# EAGLE design CANBUS Interface Board 2.2 (EAGLE 8.6.0)
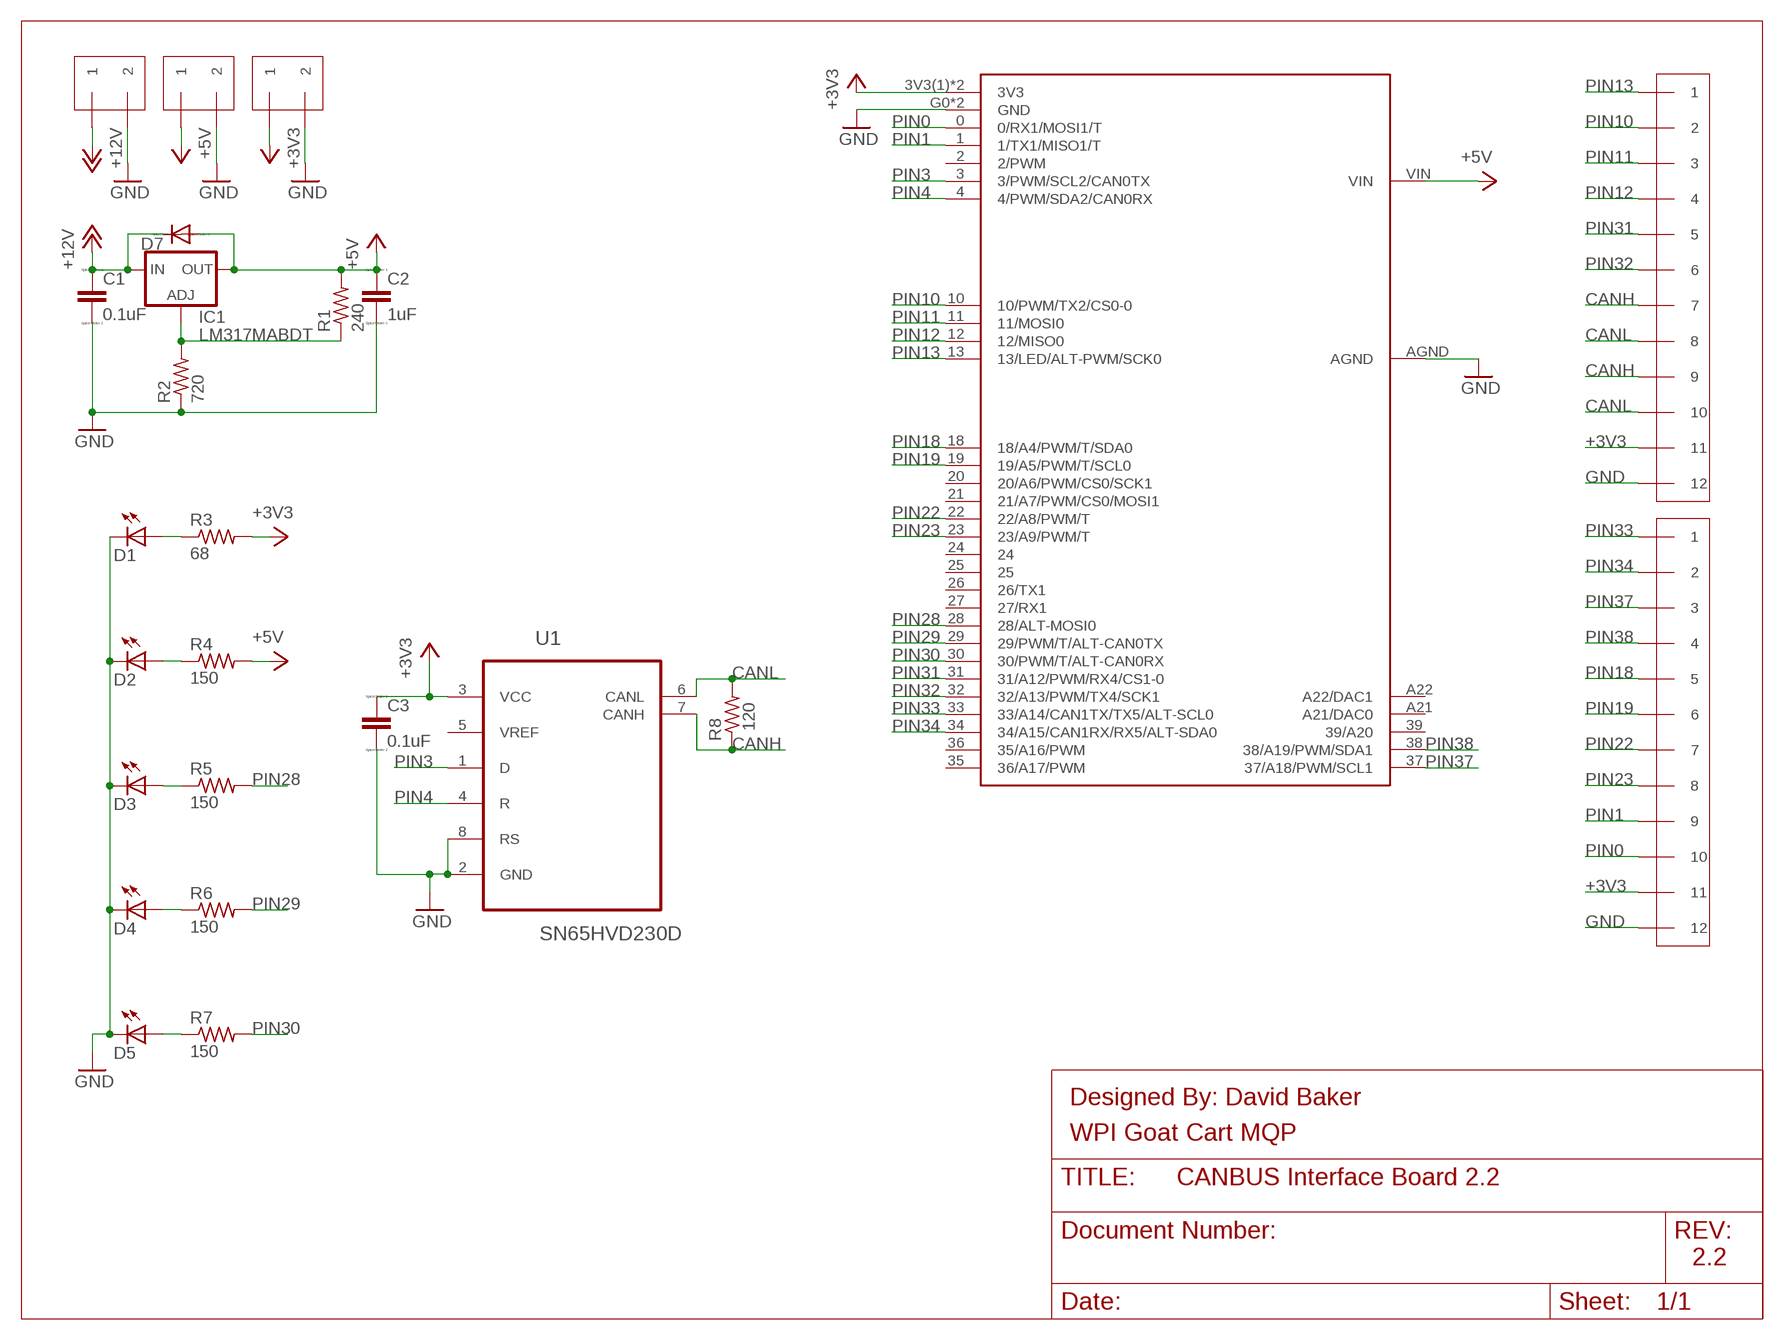
[diagram p0: schematic, sheet 1]

## Parts
C1  0.1uF  CC0603  [C0603]
C2  1uF  CC0603  [C0603]
C3  0.1uF  CC0603  [C0603]
D1  LEDSML0603  [SML0603]
D2  LEDSML0603  [SML0603]
D3  LEDSML0603  [SML0603]
D4  LEDSML0603  [SML0603]
D5  LEDSML0603  [SML0603]
D7  DIODE-DO-214AC  [DO-214AC]
IC1  LM317MABDT  [DPACK]
J1  1984617X12  [12POSTERMBLOCK]
J2  1984617X12  [12POSTERMBLOCK]
J3  1984617  [2POSTERMBLOCK]
J4  1984617  [2POSTERMBLOCK]
J5  1984617  [2POSTERMBLOCK]
R1  240  R-US_R0603  [R0603]
R2  720  R-US_R0603  [R0603]
R3  68  R-US_R0603  [R0603]
R4  150  R-US_R0603  [R0603]
R5  150  R-US_R0603  [R0603]
R6  150  R-US_R0603  [R0603]
R7  150  R-US_R0603  [R0603]
R8  120  R-US_R0603  [R0603]
U1  SN65HVD230D  [SOIC127P600X175-8N]
U2  TEENSY3_6--ALLPINS  [T36]

## Nets
+3V3: C3.1 J1.11 J2.11 J5.1 R3.2 U1.3(VCC) U2.3V3(1)(3V3) U2.3V3(3)(3V3)
+5V: C2.1 D7.A IC1.4(OUT) J4.1 R1.2 R4.2 U2.VIN
+12V: C1.1 D7.C IC1.3(IN) J3.1
CANH: J1.7 J1.9 R8.1 U1.7(CANH)
CANL: J1.8 J1.10 R8.2 U1.6(CANL)
GND: C1.2 C2.2 C3.2 D1.C D2.C D3.C D4.C D5.C J1.12 J2.12 J3.2 J4.2 J5.2 R2.1 U1.2(GND) U1.8(RS) U2.AGND U2.G0(GND) U2.G2(GND)
N$1: IC1.1(ADJ) R1.1 R2.2
N$2: D1.A R3.1
N$3: D2.A R4.1
N$4: D3.A R5.1
N$5: D4.A R6.1
N$6: D5.A R7.1
PIN0: J2.10 U2.0(0/RX1/MOSI1/T)
PIN1: J2.9 U2.1(1/TX1/MISO1/T)
PIN3: U1.1(D) U2.3(3/PWM/SCL2/CAN0TX)
PIN4: U1.4(R) U2.4(4/PWM/SDA2/CAN0RX)
PIN10: J1.2 U2.10(10/PWM/TX2/CS0-0)
PIN11: J1.3 U2.11(11/MOSI0)
PIN12: J1.4 U2.12(12/MISO0)
PIN13: J1.1 U2.13(13/LED/ALT-PWM/SCK0)
PIN18: J2.5 U2.18(18/A4/PWM/T/SDA0)
PIN19: J2.6 U2.19(19/A5/PWM/T/SCL0)
PIN22: J2.7 U2.22(22/A8/PWM/T)
PIN23: J2.8 U2.23(23/A9/PWM/T)
PIN28: R5.2 U2.28(28/ALT-MOSI0)
PIN29: R6.2 U2.29(29/PWM/T/ALT-CAN0TX)
PIN30: R7.2 U2.30(30/PWM/T/ALT-CAN0RX)
PIN31: J1.5 U2.31(31/A12/PWM/RX4/CS1-0)
PIN32: J1.6 U2.32(32/A13/PWM/TX4/SCK1)
PIN33: J2.1 U2.33(33/A14/CAN1TX/TX5/ALT-SCL0)
PIN34: J2.2 U2.34(34/A15/CAN1RX/RX5/ALT-SDA0)
PIN37: J2.3 U2.37(37/A18/PWM/SCL1)
PIN38: J2.4 U2.38(38/A19/PWM/SDA1)
Unconnected: U1.5(VREF) U2.2(2/PWM) U2.20(20/A6/PWM/CS0/SCK1) U2.21(21/A7/PWM/CS0/MOSI1) U2.24 U2.25 U2.26(26/TX1) U2.27(27/RX1) U2.35(36/A17/PWM) U2.36(35/A16/PWM) U2.39(39/A20) U2.A21(A21/DAC0) U2.A22(A22/DAC1)

## Notes on the sheet
- Designed By: David Baker
- WPI Goat Cart MQP
- 2.2

## Library data of the parts
C1-C3 = eagle-ltspice:C: CAPACITOR, European symbol; SPICEMODEL: NONE; SPICEPREFIX: C
D1-D5 = led:LED: LED OSRAM: - CHIPLED LG R971, LG N971, LY N971, LG Q971, LY Q971, LO R971, LY R971 LH N974, LH R974 LS Q976, LO Q976, LY Q976 LO Q996 - Hyper CHIPLED LW Q18S LB Q993, LB Q99A, LB R99A - SideLED LS A670, LO A670, LY A670, LG A670, LP A670 LB A673, LV A673, LT A673, LW A673 LH A674 LY A675 LS A676, LA A676, LO A676, LY A676, LW A676 LS A679, LY A679, LG A679 - Hyper Micro SIDELED® LS Y876, LA Y876, LO Y876, LY Y876 LT Y87S - SmartLED LW L88C, LW L88S LB L89C, LB L89S, LG L890 LS L89K, LO L89K, LY L89K LS L896, LA L896, LO L896, LY L896 - TOPLED LS T670, LO T670, LY T670, LG T670, LP T670 LSG T670, LSP T670, LSY T670, LOP T670, LYG T670 LG T671, LOG T671, LSG T671 LB T673, LV T673, LT T673, LW T673 LH T674 LS T676, LA T676, LO T676, LY T676, LB T676, LH T676, LSB T676, LW T676 LB T67C, LV T67C, LT T67C, LS T67K, LO T67K, LY T67K, LW E67C LS E67B, LA E67B, LO E67B, LY E67B, LB E67C, LV E67C, LT E67C LW T67C LS T679, LY T679, LG T679 LS T770, LO T770, LY T770, LG T770, LP T770 LB T773, LV T773, LT T773, LW T773 LH T774 LS E675, LA E675, LY E675, LS T675 LS T776, LA T776, LO T776, LY T776, LB T776 LHGB T686 LT T68C, LB T68C - Hyper Mini TOPLED® LB M676 - Mini TOPLED Santana® LG M470 LS M47K, LO M47K, LY M47K Source: http://www.osram.convergy.de LUXEON: - LUMILED® LXK2-PW12-R00, LXK2-PW12-S00, LXK2-PW14-U00, LXK2-PW14-V00 LXK2-PM12-R00, LXK2-PM12-S00, LXK2-PM14-U00 LXK2-PE12-Q00, LXK2-PE12-R00, LXK2-PE12-S00, LXK2-PE14-T00, LXK2-PE14-U00 LXK2-PB12-K00, LXK2-PB12-L00, LXK2-PB12-M00, LXK2-PB14-N00, LXK2-PB14-P00, LXK2-PB14-Q00 LXK2-PR12-L00, LXK2-PR12-M00, LXK2-PR14-Q00, LXK2-PR14-R00 LXK2-PD12-Q00, LXK2-PD12-R00, LXK2-PD12-S00 LXK2-PH12-R00, LXK2-PH12-S00 LXK2-PL12-P00, LXK2-PL12-Q00, LXK2-PL12-R00 Source: www.luxeon.com KINGBRIGHT: KA-3528ASYC Source: www.kingbright.com
D7 = diode:DIODE-: DIODE
IC1 = v-reg:LM317?*: 500 mA Adjustable Output Positive Voltage Regulator Source: http://www.onsemi.co.jp .. LM317M-D.PDF
J1 J2 = MyLib:1984617X12
J3-J5 = MyLib:1984617
R1-R8 = resistor:R-US_: RESISTOR, American symbol
U1 = Texas Instruments_By_element14_Batch_1:SN65HVD230D: 3.3-V CAN TRANSCEIVERS; MPN: SN65HVD230D; OC_FARNELL: 1103105; OC_NEWARK: 75C7744; PACKAGE: SOIC-8; SUPPLIER: Texas Instruments
U2 = MyLib:TEENSY3_6--ALLPINS

## Board
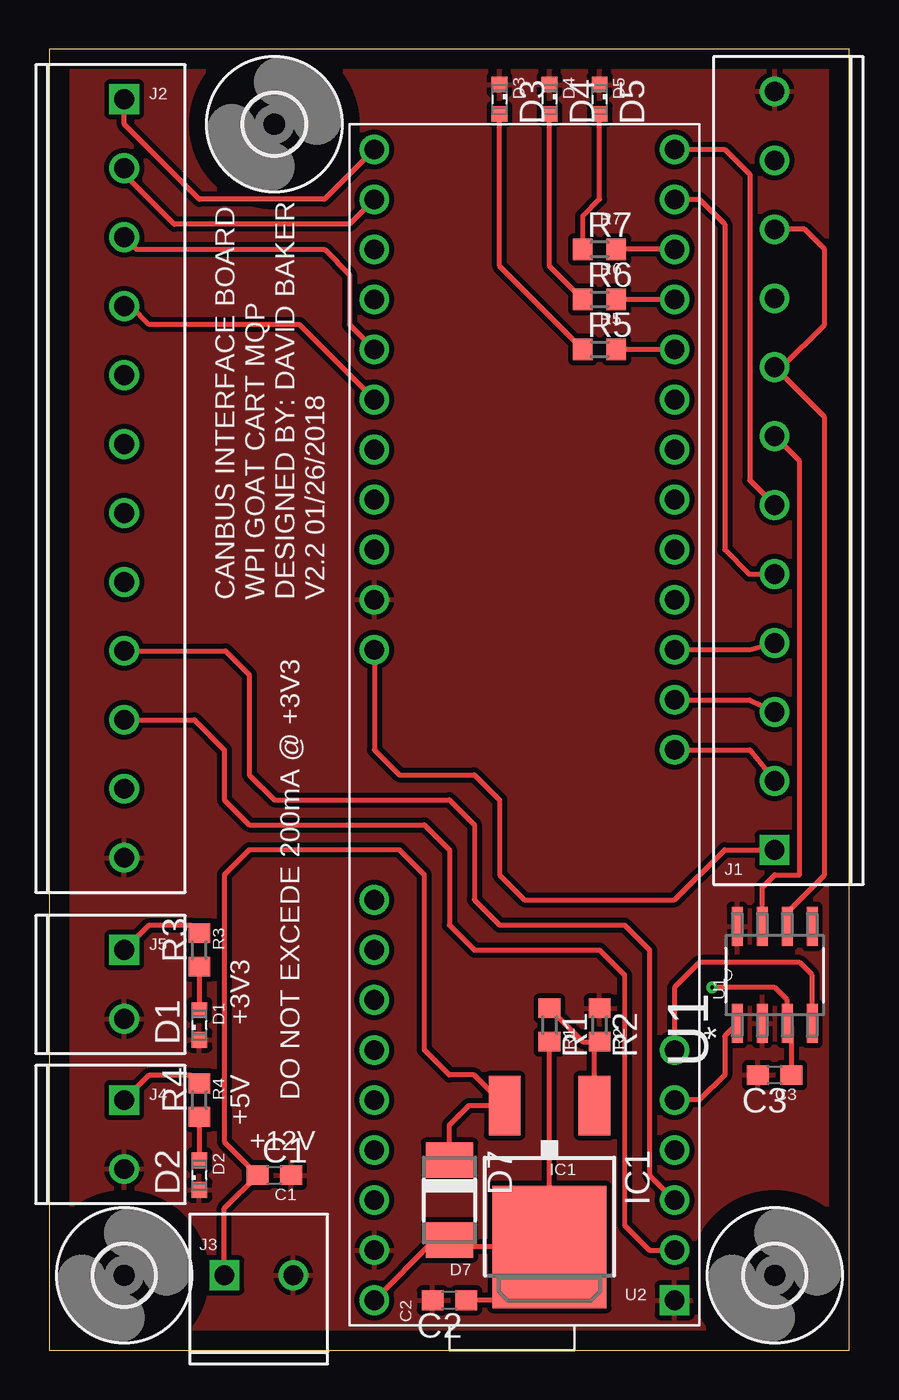
[diagram p1: board, top side]
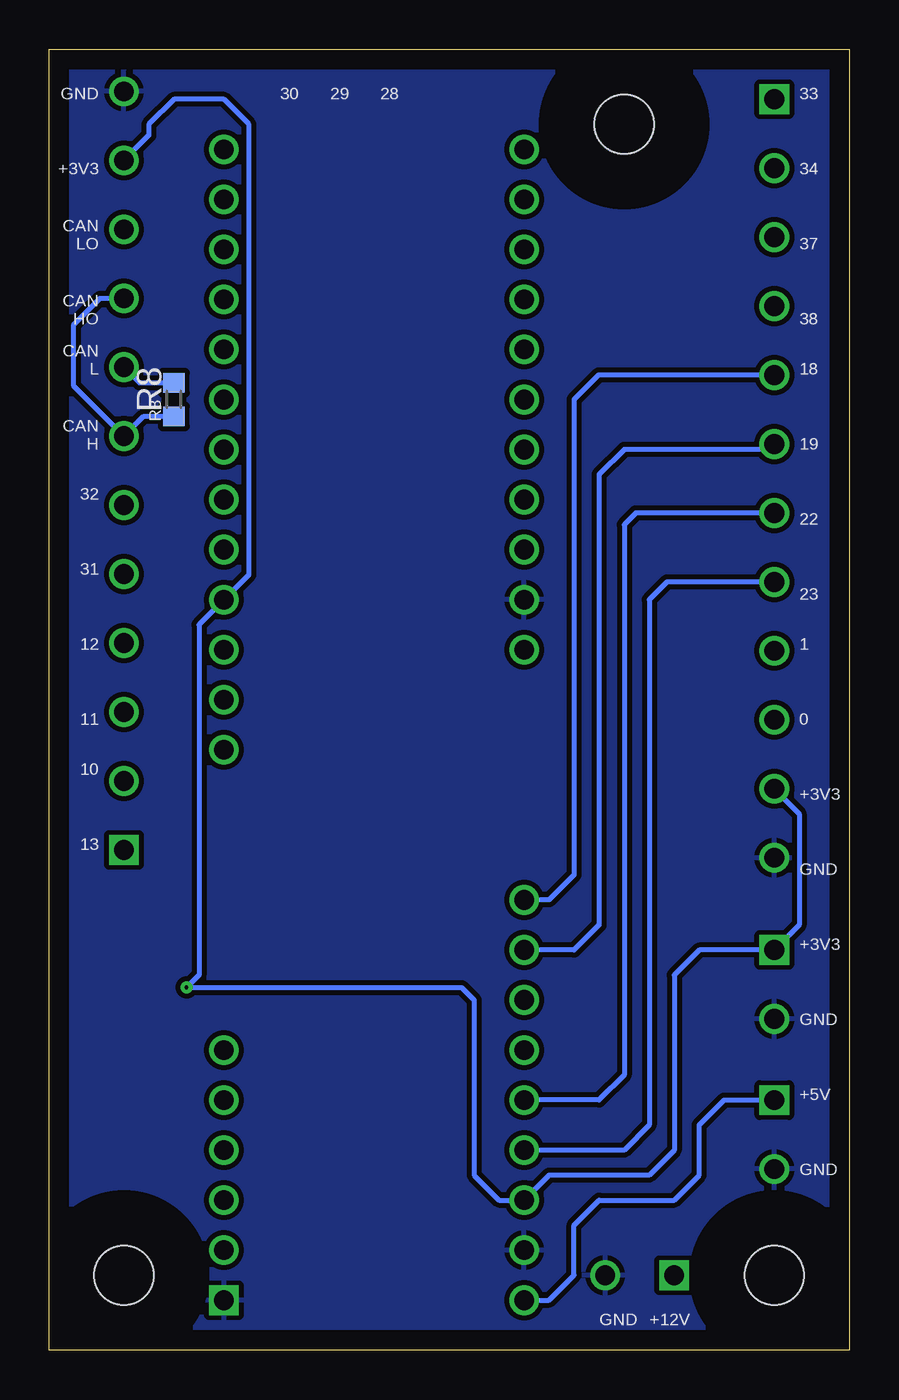
[diagram p2: board, bottom side, seen from below]

Size 40.62 x 66.04 mm. Coordinates in mm from the lower left corner, seen from the top.
Outline: 0,0 40.62,0 40.62,66.04 0,66.04 0,0
Copper layers (1*16): Top 0.035mm / dielectric 1.5mm / Bottom 0.035mm
Design rules "default": minimum track width 6mil, minimum drill 0.35mm, track to track 6mil, track to pad 6mil, pad to pad 6mil, via to via 6mil, smd to smd 6mil, copper to edge 40mil, drill to drill 6mil, minimum pad ring 10mil, minimum via ring 8mil, stop-mask expansion 4mil, vias tented up to drill 0mil, thermal gap 10mil

### Footprints (pad centres in the part's own frame; a part is rotated, then mirrored left to right if it is on the bottom)
C0603 = smd 1.1 x 1: 1 -0.85,0; 2 0.85,0
SML0603 = smd 0.8 x 0.8: A 0.75,0; C -0.75,0
DO-214AC = smd 1.8 x 2.4: A 2.025,0; C -2.025,0
DPACK = smd 1.6 x 3: 1 -2.28,-4.8; 3 2.28,-4.8 | smd 5.8 x 6.2: 4 0,2.38
12POSTERMBLOCK = drill 1 square: 1 0,0 | drill 1: 2 3.5,0; 3 7,0; 4 10.5,0; 5 14,0; 6 17.5,0; 7 21,0; 8 24.5,0; 9 28,0; 10 31.5,0; 11 35,0; 12 38.5,0
2POSTERMBLOCK = drill 1 square: 1 0,0 | drill 1: 2 3.5,0
R0603 = smd 1 x 1.1: 1 -0.85,0; 2 0.85,0
SOIC127P600X175-8N = smd 1.981 x 0.559: 1 -2.464,1.905; 2 -2.464,0.635; 3 -2.464,-0.635; 4 -2.464,-1.905; 5 2.464,-1.905; 6 2.464,-0.635; 7 2.464,0.635; 8 2.464,1.905
T36 = drill 1: 0 -15.24,-5.08; 1 -12.7,-5.08; 2 -10.16,-5.08; 3 -7.62,-5.08; 3V3(1) 17.78,-5.08; 3V3(3) -12.7,10.16; 4 -5.08,-5.08; 10 10.16,-5.08; 11 12.7,-5.08; 12 15.24,-5.08; 13 15.24,10.16; 18 2.54,10.16; 19 0,10.16; 20 -2.54,10.16; 21 -5.08,10.16; 22 -7.62,10.16; 23 -10.16,10.16; 24 20.32,-5.08; 25 22.86,-5.08; 26 25.4,-5.08; 27 27.94,-5.08; 28 30.48,-5.08; 29 33.02,-5.08; 30 35.56,-5.08; 31 38.1,-5.08; 32 40.64,-5.08; 33 40.64,10.16; 34 38.1,10.16; 35 35.56,10.16; 36 33.02,10.16; 37 30.48,10.16; 38 27.94,10.16; 39 25.4,10.16; A21 22.86,10.16; A22 20.32,10.16; AGND -15.24,10.16; G2 17.78,10.16; VIN -17.78,10.16 | drill 1 square: G0 -17.78,-5.08
3,0 = hole 3: 0,0

### Placement (x,y rotation side)
C1  11.43,8.89 0 top
C2  20.32,2.54 180 top
C3  36.83,13.97 180 top
D1  7.62,16.51 90 top
D2  7.62,8.89 90 top
D3  22.86,63.5 270 top
D4  25.4,63.5 270 top
D5  27.94,63.5 270 top
D7  20.32,7.62 270 top
IC1  25.4,7.62 180 top
J1  36.83,25.4 90 top
J2  3.81,63.5 270 top
J3  8.89,3.81 0 top
J4  3.81,12.7 270 top
J5  3.81,20.32 270 top
R1  25.4,16.51 270 top
R2  27.94,16.51 270 top
R3  7.62,20.32 90 top
R4  7.62,12.7 90 top
R5  27.94,50.8 0 top
R6  27.94,53.34 0 top
R7  27.94,55.88 0 top
R8  34.29,48.26 90 bottom
U1  36.83,19.05 90 top
U2  26.67,20.32 90 top
U$1  [3,0]  3.81,3.81 0 top
U$2  [3,0]  36.83,3.81 0 top
U$3  [3,0]  11.43,62.23 0 top

### Tracks (layer width: path | path; a pad name or v marks a point on that pad's centre or on a via)
+3V3  (via drill 0.2)
  Top 0.254: J5.1 5.08,21.59 7.2,21.59 R3.2 | C3.1 37.68,16.37 U1.3 37.47,17.78 36.83,18.41 v33.66,18.41
  Bottom 0.254: J2.11 2.54,27.23 2.54,21.59 J5.1 7.62,20.32 8.89,19.05 8.89,10.16 10.16,8.89 15.24,8.89 U2.3V3(3) 17.78,7.62 19.05,8.89 19.05,17.78 19.68,18.41 v33.66,18.41 33.02,19.05 33.02,36.83 U2.3V3(1) 30.48,39.37 30.48,62.23 31.75,63.5 34.29,63.5 35.56,62.23 35.56,61.67 J1.11
+5V
  Top 0.254: J4.1 5.08,13.97 7.2,13.97 R4.2 | IC1.4 20.68,5.24 D7.A 19.57,5.59 U2.VIN | IC1.4 R1.2 | IC1.4 22.7,2.54 C2.1
  Bottom 0.254: U2.VIN 15.24,2.54 13.97,3.81 13.97,6.35 12.7,7.62 8.89,7.62 7.62,8.89 7.62,11.43 6.35,12.7 J4.1
+12V
  Top 0.254: D7.C 20.32,11.43 21.31,12.42 IC1.3 21.57,13.97 20.32,13.97 19.05,15.24 19.05,24.13 17.78,25.4 10.16,25.4 8.89,24.13 8.89,10.58 C1.1 8.89,7.2 J3.1
CANH
  Top 0.254: U1.7 36.2,23.5 36.83,24.13 38.1,24.13 38.1,45.13 J1.7
  Bottom 0.254: J1.9 38.04,53.4 39.37,52.07 39.37,48.94 J1.7 35.82,47.41 R8.1
CANL
  Top 0.254: U1.6 37.47,22.23 39.37,24.13 39.37,47.36 J1.8 37.2,49.9 39.37,52.07 39.37,55.88 38.35,56.9 J1.10
  Bottom 0.254: J1.8 36.04,49.11 R8.2
GND
  pour Top (isolate 0.254): 0,0 0,66.04 40.64,66.04 40.64,0
  pour Bottom (isolate 0.254): 0,0 0,66.04 40.64,66.04 40.64,0
N$1
  Top 0.254: IC1.1 27.68,15.4 R2.2 27.1,15.66 R1.1
N$2
  Top 0.254: R3.1 D1.A
N$3
  Top 0.254: R4.1 D2.A
N$4
  Top 0.254: R5.1 22.86,55.03 D3.A
N$5
  Top 0.254: R6.1 25.4,55.03 D4.A
N$6
  Top 0.254: R7.1 27.09,57.57 27.94,58.42 D5.A
PIN0
  Top 0.254: J2.10 7.37,32 8.89,30.48 8.89,27.94 10.16,26.67 19.05,26.67 20.32,25.4 20.32,21.59 21.59,20.32 27.94,20.32 29.21,19.05 29.21,6.35 30.48,5.08 U2.0
PIN1
  Top 0.254: J2.9 8.95,35.5 10.16,34.29 10.16,29.21 11.43,27.94 20.32,27.94 21.59,26.67 21.59,22.86 22.86,21.59 29.21,21.59 30.48,20.32 30.48,8.89 U2.1
PIN3
  Top 0.254: U1.1 34.29,15.95 34.29,13.97 33.02,12.7 U2.3
PIN4
  Top 0.254: U1.4 38.73,19.05 38.1,19.68 33.02,19.68 31.75,18.41 U2.4
PIN10
  Top 0.254: U2.10 35.56,30.48 J1.2
PIN11
  Top 0.254: U2.11 35.56,33.02 J1.3
PIN12
  Top 0.254: U2.12 35.56,35.56 J1.4
PIN13
  Top 0.254: U2.13 16.51,30.48 17.78,29.21 21.59,29.21 22.86,27.94 22.86,24.13 24.13,22.86 31.75,22.86 34.29,25.4 J1.1
PIN18
  Bottom 0.254: J2.5 12.73,49.5 13.97,48.26 13.97,24.13 15.24,22.86 U2.18
PIN19
  Bottom 0.254: J2.6 4.09,45.72 11.43,45.72 12.7,44.45 12.7,21.59 13.97,20.32 U2.19
PIN22
  Bottom 0.254: J2.7 10.84,42.5 11.43,41.91 11.43,13.97 12.7,12.7 U2.22
PIN23
  Bottom 0.254: J2.8 9.26,39 10.16,38.1 10.16,11.43 11.43,10.16 U2.23
PIN28
  Top 0.254: U2.28 R5.2
PIN29
  Top 0.254: U2.29 R6.2
PIN30
  Top 0.254: U2.30 R7.2
PIN31
  Top 0.254: U2.31 33.02,58.42 34.29,57.15 34.29,40.64 35.53,39.4 J1.5
PIN32
  Top 0.254: U2.32 34.29,60.96 35.56,59.69 35.56,44.17 J1.6
PIN33
  Top 0.254: U2.33 13.97,58.42 7.62,58.42 3.81,62.23 J2.1
PIN34
  Top 0.254: U2.34 15.24,57.15 6.35,57.15 3.81,59.69 J2.2
PIN37
  Top 0.254: J2.3 4.43,55.88 13.97,55.88 15.24,54.61 15.24,52.07 U2.37
PIN38
  Top 0.254: U2.38 12.7,52.07 5.08,52.07 4.15,53 J2.4

### Text on the board
tPlace: J2 | D3 | D4 | D5 | R7 | R6 | R5 | CANBUS INTERFACE BOARD / WPI GOAT CART MQP / DESIGNED BY: DAVID BAKER / V2.2 01/26/2018 | J1 | J5 | R3 | U1 | D1 | +3V3 | R1 | R2 | J4 | R4 | DO NOT EXCEDE 200mA @ +3V3 | C3 | +5V | +12V | D2 | IC1 | C1 | J3 | D7 | C2 | U2
bPlace: 33 | 28 | 29 | 30 | GND | 34 | +3V3 | 37 | CAN / LO | 38 | CAN / HO | 18 | CAN / L | R8 | 19 | CAN / H | 32 | 22 | 31 | 23 | 1 | 12 | 0 | 11 | 10 | +3V3 | 13 | GND | +3V3 | GND | +5V | GND | +12V | GND
_tsilk: C1